# Altium schematic sheet mcu.SchDoc
size A
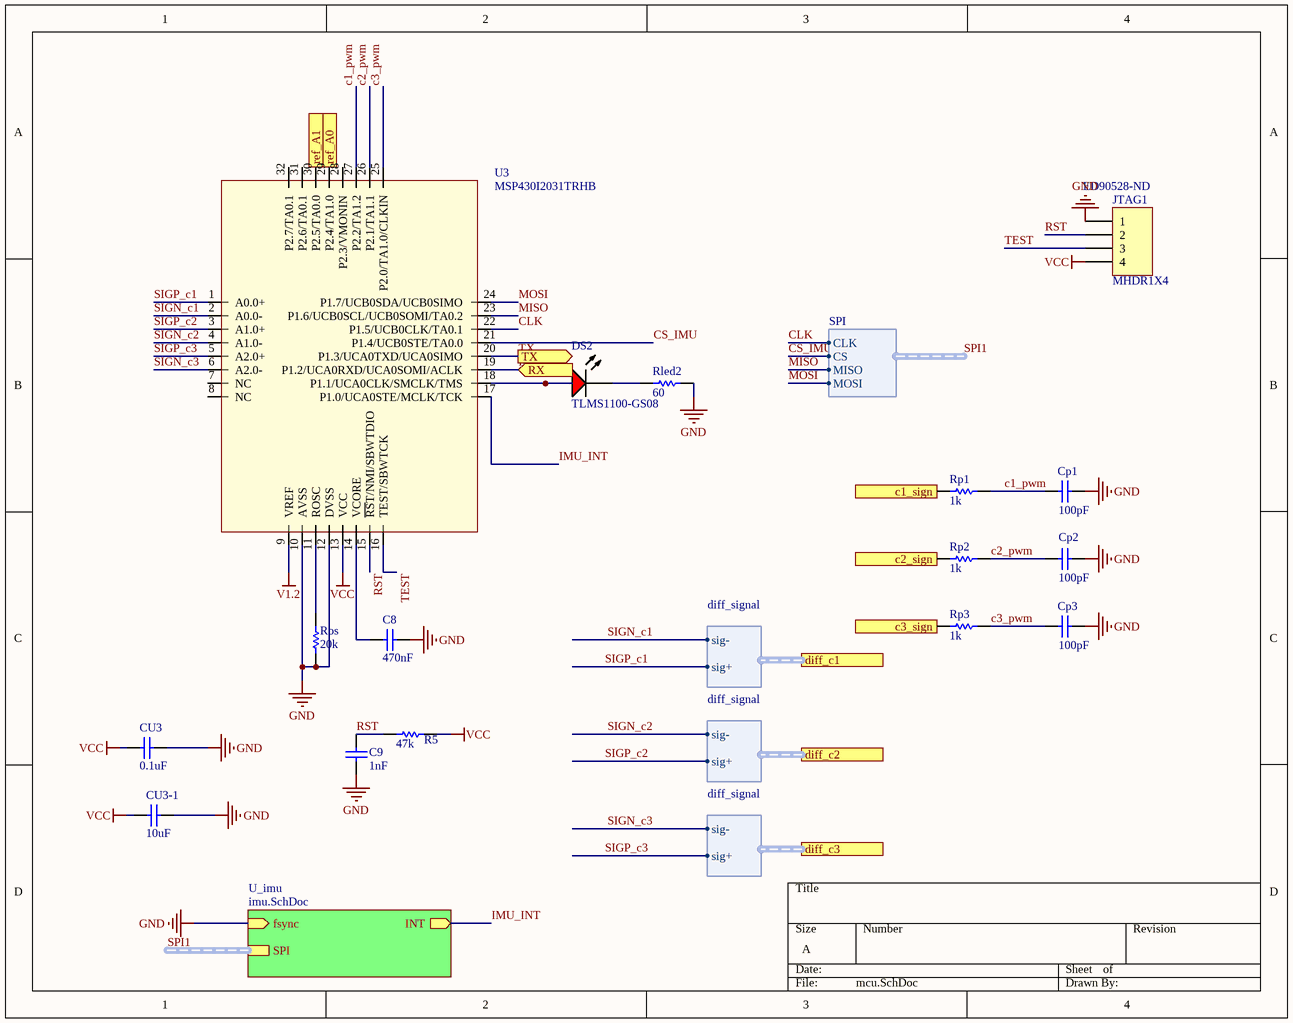
[diagram p0: mcu.SchDoc]

## Parts
C8  value 470nF  [0402]  (hidden comment: Cap)
C9  value 1nF  [0402]  (hidden comment: Cap)
Cp1  value 100pF  [0402]  (hidden comment: Cap)
Cp2  value 100pF  [0402]  (hidden comment: Cap)
Cp3  value 100pF  [0402]  (hidden comment: Cap)
CU3  value 0.1uF  [0402]  (hidden comment: Cap)
CU3-1  value 10uF  [0402]  (hidden comment: Cap)
DS2  TLMS1100-GS08  [VISH-TLMX1100_V]
JTAG1  MHDR1X4  Supplier Part Number 1: ED90528-ND  [MHDR1X4]
R5  value 47k  [0402]  (hidden comment: Res)
Rled2  value 60  [0402]  (hidden comment: Res)
Ros  value 20k  [0402]  (hidden comment: Res)
Rp1  value 1k  [0402]  (hidden comment: Res)
Rp2  value 1k  [0402]  (hidden comment: Res)
Rp3  value 1k  [0402]  (hidden comment: Res)
U3  MSP430I2031TRHB  [QFN50P500X500X100_HS-33N]

## Sub-sheets
U_imu = imu.SchDoc: fsync (in), INT (out), SPI (harness SPI)

## Ports
c1_sign (in), c2_sign (in), c3_sign (in), diff_c1 (harness diff_signal), diff_c2 (harness diff_signal), diff_c3 (harness diff_signal), ref_A0 (out), ref_A1 (out), RX (in), TX (out)

## Harnesses
SPI: CLK, CS, MISO, MOSI
diff_signal: sig+, sig-

## Nets
GND: C8.1 C9.1 Cp1.1 Cp2.1 Cp3.1 CU3.1 CU3-1.1 JTAG1.1 Rled2.2 Ros.1 U3.10(AVSS) U3.12(DVSS) ; sheet U_imu/fsync
V1.2: U3.9(VREF)
VCC: CU3.2 CU3-1.2 JTAG1.4 R5.2 U3.13(VCC)
c1_pwm: Cp1.2 Rp1.2 U3.27(P2.2/TA1.2)
c1_sign: Rp1.1 ; port c1_sign
c2_pwm: Cp2.2 Rp2.2 U3.26(P2.1/TA1.1)
c2_sign: Rp2.1 ; port c2_sign
c3_pwm: Cp3.2 Rp3.2 U3.25(P2.0/TA1.0/CLKIN)
c3_sign: Rp3.1 ; port c3_sign
CLK: U3.22(P1.5/UCB0CLK/TA0.1) ; sheet U_imu/SPI.CLK
CS_IMU: U3.21(P1.4/UCB0STE/TA0.0) ; sheet U_imu/SPI.CS
IMU_INT: U3.17(P1.0/UCA0STE/MCLK/TCK) ; sheet U_imu/INT
MISO: U3.23(P1.6/UCB0SCL/UCB0SOMI/TA0.2) ; sheet U_imu/SPI.MISO
MOSI: U3.24(P1.7/UCB0SDA/UCB0SIMO) ; sheet U_imu/SPI.MOSI
ref_A0: U3.29(P2.4/TA1.0) ; port ref_A0
ref_A1: U3.30(P2.5/TA0.0) ; port ref_A1
RST: C9.2 JTAG1.2 R5.1 U3.15(~{RS}T/NMI/SBWTDIO)
RX: U3.19(P1.2/UCA0RXD/UCA0SOMI/ACLK) ; port RX
SIGN_c1: U3.2(A0.0-) ; port diff_c1.sig-
SIGN_c2: U3.4(A1.0-) ; port diff_c2.sig-
SIGN_c3: U3.6(A2.0-) ; port diff_c3.sig-
SIGP_c1: U3.1(A0.0+) ; port diff_c1.sig+
SIGP_c2: U3.3(A1.0+) ; port diff_c2.sig+
SIGP_c3: U3.5(A2.0+) ; port diff_c3.sig+
TEST: JTAG1.3 U3.16(TEST/SBWTCK)
TX: U3.20(P1.3/UCA0TXD/UCA0SIMO) ; port TX
NetC8_2: C8.2 U3.14(VCORE)
NetDS2_1: DS2.1(A) U3.18(P1.1/UCA0CLK/SMCLK/TMS)
NetDS2_2: DS2.2(K) Rled2.1
NetRos_2: Ros.2 U3.11(ROSC)

Not connected (* = marked no-connect by the designer): U3 7(NC) 8(NC) 28(P2.3/VMONIN) 31(P2.6/TA0.1) 32(P2.7/TA0.1)

## Buses and harness runs
harness SPI1 = sheet U_imu/SPI

## Library data of the parts
C8 C9 Cp1-Cp3 CU3 CU3-1 = Cap: Ceramic Capacitor (Surface Mount); Manufacturer: Generic Ceramic Chip Cap (TBD); Digi-Key Part Number: *; Manufacturer Part Number: *; Note: *; Rating: *
DS2 = CMP-1666-00027-1: LED, RED, 2.1 V, -40 to 100 degC, 2-Pin SMD (0603), RoHS, Tape and Reel; Type (Capacitors): C0G; Resistance: 100000000000 Ohm; Capacitance: 12 pF; Voltage Rating: 50 V; Tolerance: 5%; Min Operating Temperature: -55degC; REACH SVHC: No SVHC; ComponentLink2Description: Datasheet; ComponentLink1URL: http://www.vishay.com/; Width: 0.8 mm; Package Quantity: 4000; PackageReference: TLMX1100; ComponentLink2URL: http://www.vishay.com/docs/83173/tlmb1100.pdf; Case/Package: 0603; Case Code (Metric): 1608; Packaging: Tape and Reel; Pins: 2; ComponentLink1Description: Manufacturer URL; Max Operating Temperature: 125degC; Height: 0.8 mm; Length: 1.6 mm; Mount: Surface Mount; PackageDescription: 2-Pin Surface Mount Device, Body 1.6 x 0.8 mm; DatasheetVersion: Rev. 2.7, 03/2016; Case Code (Imperial): 0603; Voltage Rating (DC): 50 V; RoHSCompliant: True; Radiation Hardening: No
JTAG1 = MHDR1X4: Header, 4-Pin; LatestRevisionDate: 17-Jul-2002; LatestRevisionNote: Re-released for DXP Platform.; Publisher: Altium Limited; Supplier 1: Digi-Key
R5 Rled2 Ros Rp1-Rp3 = Res: Chip Resistor (Surface Mount); Manufacturer: Generic Chip Res (TBD); Manufacturer Part Number: *; Digi-Key Part Number: *; Rating: *